# EAGLE design dev_board (EAGLE 5.10)
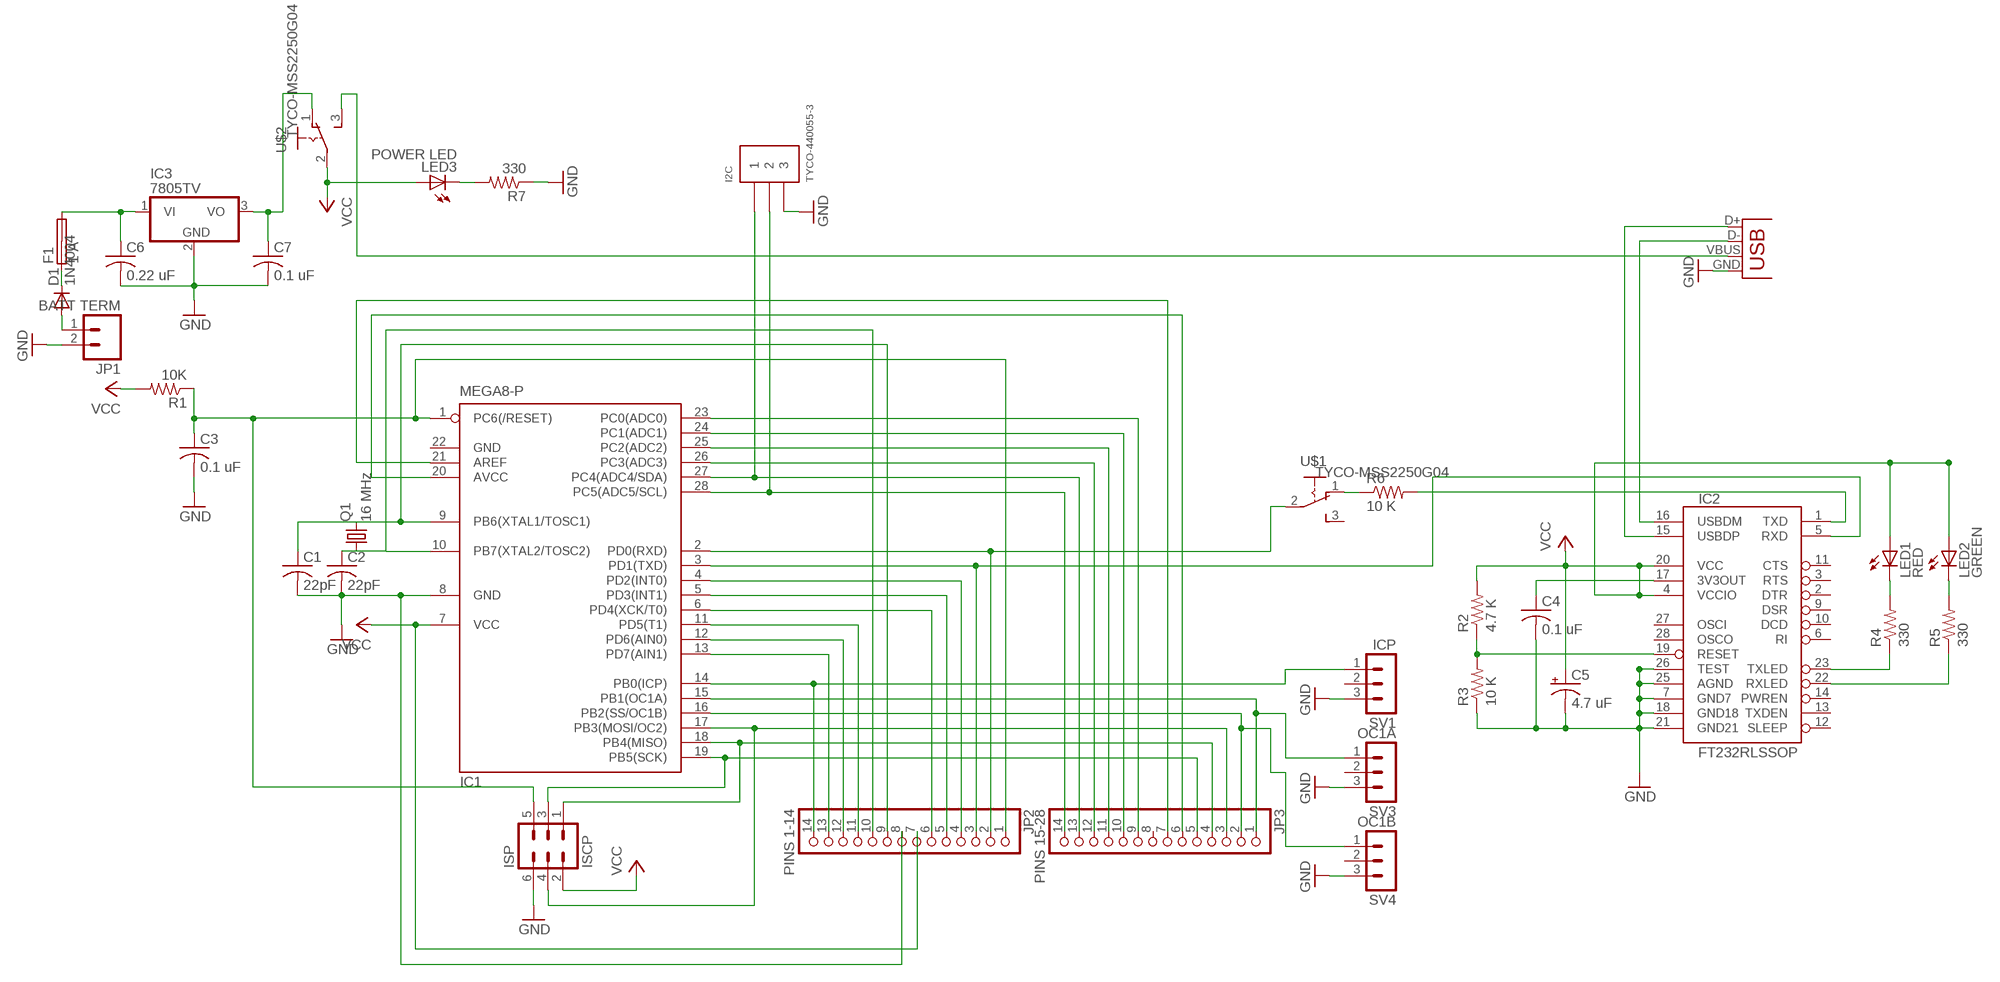
[diagram p0: schematic, sheet 1]

## Parts
C1  22pF  C-US025-025X050  [C025-025X050]
C2  22pF  C-US025-025X050  [C025-025X050]
C3  0.1 uF  C-US050-055X075  [C050-055X075]
C4  0.1 uF  C-US050-055X075  [C050-055X075]
C5  4.7 uF  CPOL-USE2.5-7  [E2,5-7]
C6  0.22 uF  C-US050-055X075  [C050-055X075]
C7  0.1 uF  C-US050-055X075  [C050-055X075]
D1  1N4004  [DO41-10]
F1  1 A  SHK20Q  [SHK20Q]
I2C  TYCO-440055-3  [HEADER-RA-2.00MM-3]
IC1  MEGA8-P  [DIL28-3]
IC2  FT232RLSSOP  [SSOP28DB]
IC3  7805TV  [TO220V]
ISP  ISCP  MA03-2  [MA03-2]
JP1  BATT TERM  M02POLAR  [MOLEX-1X2]
JP2  PINS 1-14  PINHD-1X14  [1X14]
JP3  PINS 15-28  PINHD-1X14  [1X14]
LED1  RED  LED3MM  [LED3MM]
LED2  GREEN  LED3MM  [LED3MM]
LED3  POWER LED  LED3MM  [LED3MM]
Q1  16 MHz  CRYSTALHC18U-V  [HC18U-V]
R1  10K  R-US_0207/10  [0207/10]
R2  4.7 K  R-US_0207/10  [0207/10]
R3  10 K  R-US_0207/10  [0207/10]
R4  330  R-US_0207/10  [0207/10]
R5  330  R-US_0207/10  [0207/10]
R6  10 K  R-US_0207/10  [0207/10]
R7  330  R-US_0207/10  [0207/10]
SV1  ICP  MA03-1  [MA03-1]
SV3  OC1A  MA03-1  [MA03-1]
SV4  OC1B  MA03-1  [MA03-1]
U$1  TYCO-MSS2250G04  [TYCO-MSS2250G04]
U$2  TYCO-MSS2250G04  [TYCO-MSS2250G04]
X1  USBPTH  [USB-B-PTH]

## Nets
GND: C1.2 C2.2 C3.2 C4.2 C5.- C6.2 C7.2 I2C.3 IC1.8(GND) IC2.7(GND7) IC2.18(GND18) IC2.21(GND21) IC2.25(AGND) IC2.26(TEST) IC3.2(GND) ISP.6 JP1.2 JP2.8 R3.1 R7.1 SV1.3 SV3.3 SV4.3 X1.GND
N$1: C1.1 IC1.9(PB6(XTAL1/TOSC1)) JP2.9 Q1.2
N$2: C2.1 IC1.10(PB7(XTAL2/TOSC2)) JP2.10 Q1.1
N$3: R6.1 U$1.1(O)
N$4: C6.1 F1.2A IC3.1(VI)
N$5: U$2.3(S) X1.VBUS
N$6: D1.C F1.1A
N$7: C7.1 IC3.3(VO) U$2.1(O)
N$8: IC1.19(PB5(SCK)) ISP.3 JP3.5
N$9: IC1.18(PB4(MISO)) ISP.1 JP3.4
N$10: IC1.17(PB3(MOSI/OC2)) ISP.4 JP3.3
N$11: C4.1 IC2.17(3V3OUT)
N$12: C3.1 IC1.1(PC6(/RESET)) ISP.5 JP2.1 R1.1
N$13: IC2.1(TXD) R6.2
N$14: D1.A JP1.1
N$15: IC2.16(USBDM) X1.D-
N$16: IC2.15(USBDP) X1.D+
N$17: IC2.19(RESET) R2.1 R3.2
N$18: IC1.4(PD2(INT0)) JP2.4
N$19: LED1.K(C) R4.2
N$20: LED2.K(C) R5.2
N$21: IC2.23(TXLED) R4.1
N$22: IC2.22(RXLED) R5.1
N$23: IC1.5(PD3(INT1)) JP2.5
N$24: IC1.6(PD4(XCK/T0)) JP2.6
N$25: IC1.15(PB1(OC1A)) JP3.1 SV3.1
N$26: IC1.11(PD5(T1)) JP2.11
N$27: IC1.12(PD6(AIN0)) JP2.12
N$28: IC1.13(PD7(AIN1)) JP2.13
N$29: IC1.14(PB0(ICP)) JP2.14 SV1.1
N$30: IC1.16(PB2(SS/OC1B)) JP3.2 SV4.1
N$31: IC1.20(AVCC) JP3.6
N$32: IC1.21(AREF) JP3.7
N$33: IC1.23(PC0(ADC0)) JP3.9
N$34: IC1.24(PC1(ADC1)) JP3.10
N$35: IC1.25(PC2(ADC2)) JP3.11
N$36: IC1.26(PC3(ADC3)) JP3.12
N$37: I2C.1 IC1.27(PC4(ADC4/SDA)) JP3.13
N$38: IC1.3(PD1(TXD)) IC2.5(RXD) JP2.3
N$39: I2C.2 IC1.28(PC5(ADC5/SCL)) JP3.14
N$40: IC1.2(PD0(RXD)) JP2.2 U$1.2(P)
N$41: LED3.K(C) R7.2
VCC: C5.+ IC1.7(VCC) IC2.4(VCCIO) IC2.20(VCC) ISP.2 JP2.7 LED1.A LED2.A LED3.A R1.2 R2.2 U$2.2(P)
Unconnected: F1.1B F1.2B IC2.2(DTR) IC2.3(RTS) IC2.6(RI) IC2.9(DSR) IC2.10(DCD) IC2.11(CTS) IC2.12(SLEEP) IC2.13(TXDEN) IC2.14(PWREN) IC2.27(OSCI) IC2.28(OSCO) JP3.8 SV1.2 SV3.2 SV4.2 U$1.3(S)

## Power pins joined to a net without a drawn wire
GND: IC1.22(GND)

## Library data of the parts
C1-C4 C6 C7 = resistor:C-US: CAPACITOR, American symbol
C5 = resistor:CPOL-US: POLARIZED CAPACITOR, American symbol
D1 = diode:1N4004: DIODE general purpose rectifier, 1 A
F1 = fuse:SHK20Q: FUSE HOLDER 5 x 20 mm, SH contact, E1207 Buerklin 64G6061
I2C = chicagoedt:TYCO-440055-3: 3 pin right angle header with shroud and 2.00 mm pitch.
IC1 = atmel:MEGA8-P: MICROCONTROLLER 8 Kbytes FLASH, 1 kbytes SRAM, 512 bytes EEPROM, USART, 4-channel 10 bit ADC, 2-channel 8 bit ADC Pin compatible with Atmega48, ATMega88, ATMega168 Source: avr.lbr
IC2 = SparkFun:FT232RL: USB UART FT232RL 4th Generation USB UART (USB <-> Serial) Controller. Spark Fun Electronics SKU : COM-00650
IC3 = linear:78*: Positive VOLTAGE REGULATOR Source: http://cache.national.com/ds/LM/LM78L05.pdf http://www.fairchildsemi.com/ds/LM/LM7805.pdf
ISP = con-lstb:MA03-2: PIN HEADER
JP1 = SparkFun:M02: Header 2 Standard 2-pin 0.1" header. Use with straight break away headers (SKU : PRT-00116), right angle break away headers (PRT-00553), swiss pins (PRT-00743), machine pins (PRT-00117), and female headers (PRT-00115). Molex polarized connector foot print use with SKU : PRT-08233 with associated crimp pins and housings.
JP2 JP3 = pinhead:PINHD-1X14: PIN HEADER
LED1 LED2 = led:LED: LED OSRAM: - CHIPLED LG R971, LG N971, LY N971, LG Q971, LY Q971, LO R971, LY R971 LH N974, LH R974 LS Q976, LO Q976, LY Q976 LO Q996 - Hyper CHIPLED LW Q18S LB Q993, LB Q99A, LB R99A - SideLED LS A670, LO A670, LY A670, LG A670, LP A670 LB A673, LV A673, LT A673, LW A673 LH A674 LY A675 LS A676, LA A676, LO A676, LY A676, LW A676 LS A679, LY A679, LG A679 - Hyper Micro SIDELED® LS Y876, LA Y876, LO Y876, LY Y876 LT Y87S - SmartLED LW L88C, LW L88S LB L89C, LB L89S, LG L890 LS L89K, LO L89K, LY L89K LS L896, LA L896, LO L896, LY L896 - TOPLED LS T670, LO T670, LY T670, LG T670, LP T670 LSG T670, LSP T670, LSY T670, LOP T670, LYG T670 LG T671, LOG T671, LSG T671 LB T673, LV T673, LT T673, LW T673 LH T674 LS T676, LA T676, LO T676, LY T676, LB T676, LH T676, LSB T676, LW T676 LB T67C, LV T67C, LT T67C, LS T67K, LO T67K, LY T67K, LW E67C LS E67B, LA E67B, LO E67B, LY E67B, LB E67C, LV E67C, LT E67C LW T67C LS T679, LY T679, LG T679 LS T770, LO T770, LY T770, LG T770, LP T770 LB T773, LV T773, LT T773, LW T773 LH T774 LS E675, LA E675, LY E675, LS T675 LS T776, LA T776, LO T776, LY T776, LB T776 LHGB T686 LT T68C, LB T68C - Hyper Mini TOPLED® LB M676 - Mini TOPLED Santana® LG M470 LS M47K, LO M47K, LY M47K Source: http://www.osram.convergy.de LUXEON: - LUMILED® LXK2-PW12-R00, LXK2-PW12-S00, LXK2-PW14-U00, LXK2-PW14-V00 LXK2-PM12-R00, LXK2-PM12-S00, LXK2-PM14-U00 LXK2-PE12-Q00, LXK2-PE12-R00, LXK2-PE12-S00, LXK2-PE14-T00, LXK2-PE14-U00 LXK2-PB12-K00, LXK2-PB12-L00, LXK2-PB12-M00, LXK2-PB14-N00, LXK2-PB14-P00, LXK2-PB14-Q00 LXK2-PR12-L00, LXK2-PR12-M00, LXK2-PR14-Q00, LXK2-PR14-R00 LXK2-PD12-Q00, LXK2-PD12-R00, LXK2-PD12-S00 LXK2-PH12-R00, LXK2-PH12-S00 LXK2-PL12-P00, LXK2-PL12-Q00, LXK2-PL12-R00 Source: www.luxeon.com KINGBRIGHT: KA-3528ASYC Source: www.kingbright.com
LED3 = SparkFun:LED: LEDs Standard schematic elements and footprints for 5mm, 3mm, 1206, and 0603 sized LEDs. 5mm - Spark Fun Electronics SKU : COM-00529 (and others)
Q1 = crystal:CRYSTAL: CRYSTAL
R1-R7 = resistor:R-US_: RESISTOR, American symbol
SV1 SV3 SV4 = con-lstb:MA03-1: PIN HEADER
U$1 U$2 = chicagoedt:TYCO-MSS2250G04: Switch slide 2POS Tyco Electronics
X1 = SparkFun:USB: USB Connectors USB-B-PTH is fully proven SKU : PRT-00139 USB-miniB is fully proven SKU : PRT-00587 USB-A-PCB is untested. USB-A-H is throughly reviewed, but untested. Spark Fun Electronics SKU : PRT-00437 USB-B-SMT is throughly reviewed, but untested. Needs silkscreen touching up. USB-A-S has not been used/tested USB-MB-H has not been used/tested

## Board
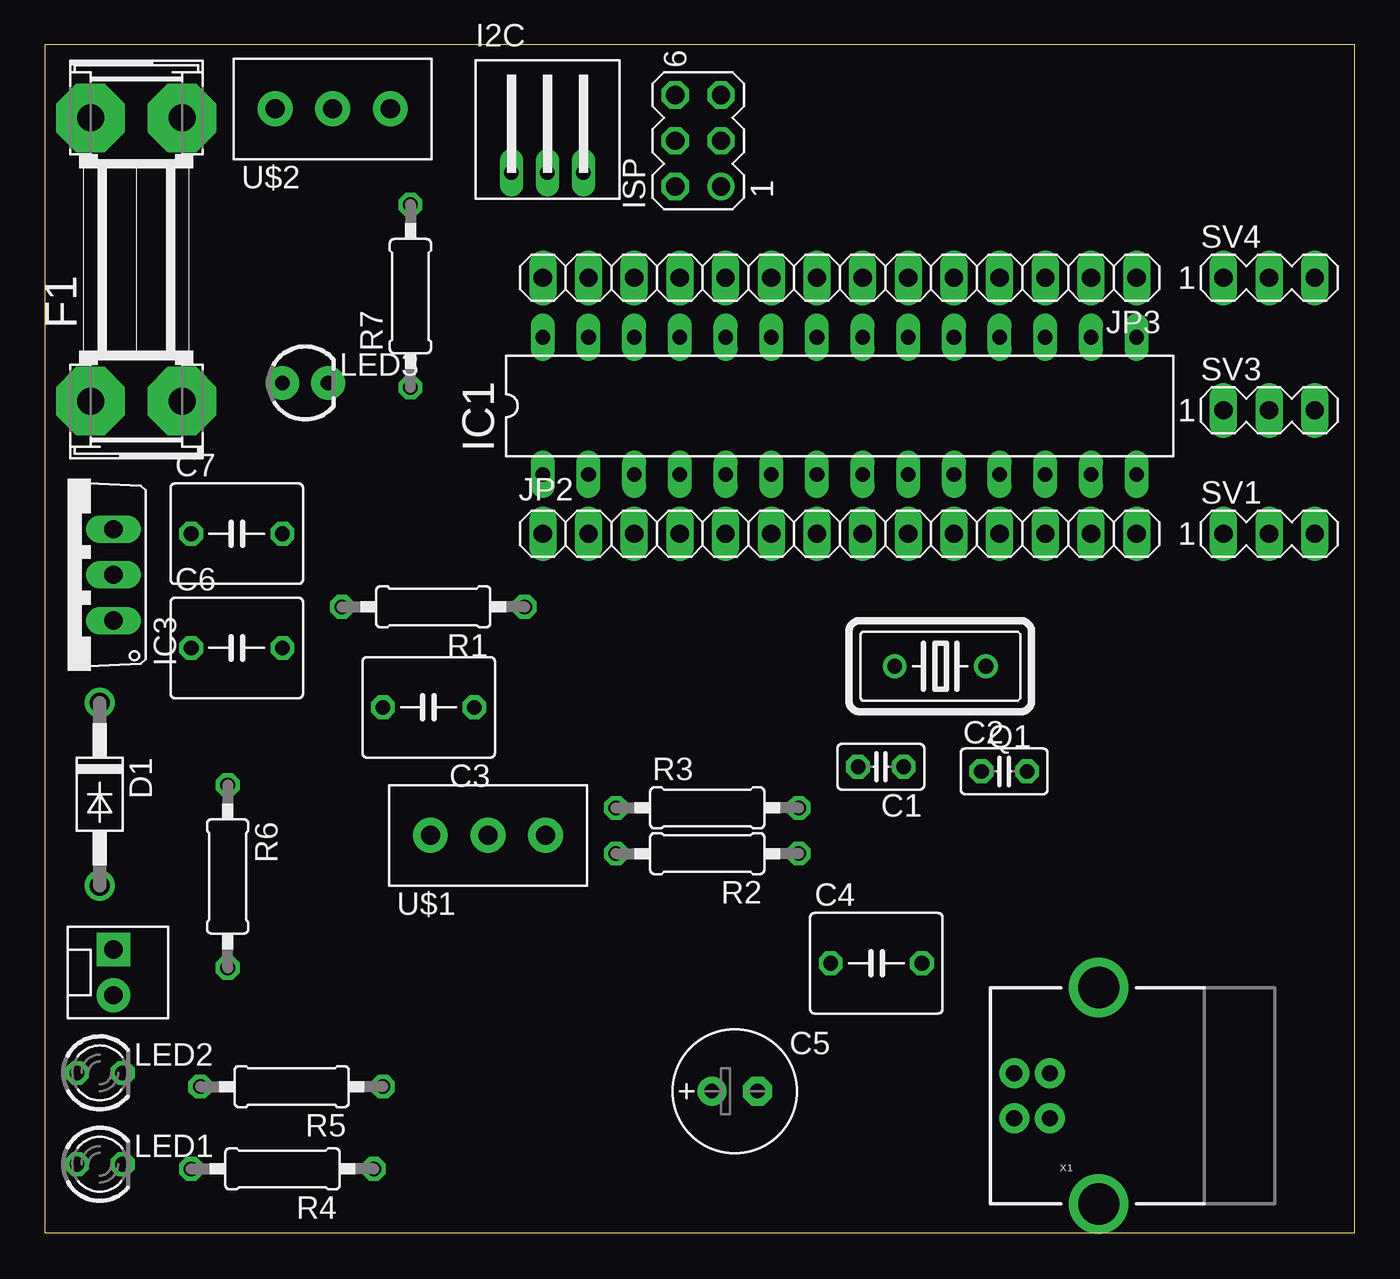
[diagram p1: board, top side]
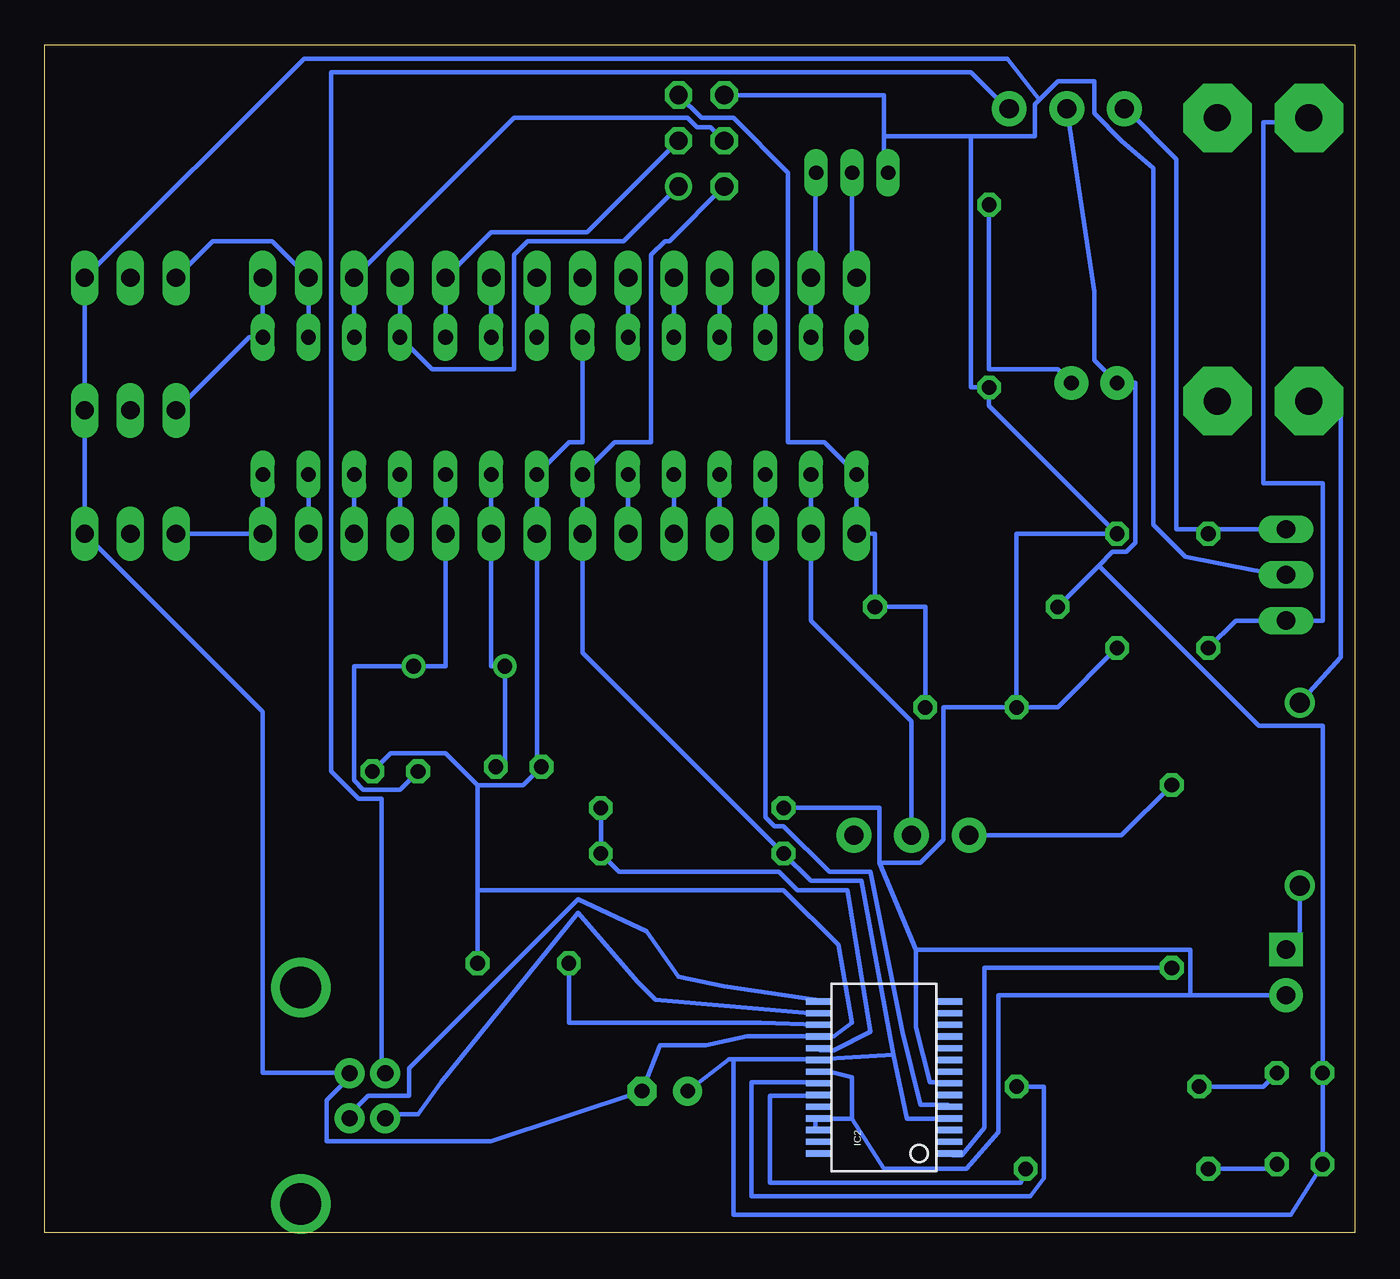
[diagram p2: board, bottom side, seen from below]

Size 72.82 x 66.03 mm. Coordinates in mm from the lower left corner, seen from the top.
Outline: 0,0 72.82,0 72.82,66.03 0,66.03 0,0
Copper layers (1*16): Top 0.035mm / dielectric 1.5mm / Bottom 0.035mm
Design rules "default": minimum track width 10mil, minimum drill 24mil, track to track 8mil, track to pad 8mil, pad to pad 8mil, via to via 8mil, smd to smd 8mil, copper to edge 40mil, drill to drill 8mil, minimum pad ring 10mil, minimum via ring 8mil, stop-mask expansion 4mil, vias tented up to drill 0mil, thermal gap 10mil

### Footprints (pad centres in the part's own frame; a part is rotated, then mirrored left to right if it is on the bottom)
C025-025X050 = drill 0.813 octagon: 1 -1.27,0; 2 1.27,0
C050-055X075 = drill 0.813 octagon: 1 -2.54,0; 2 2.54,0
E2,5-7 = drill 0.813 pad 1.6 round: + -1.27,0 | drill 0.813 pad 1.6 octagon: - 1.27,0
DO41-10 = drill 1.118 round: A 5.08,0; C -5.08,0
SHK20Q = drill 1.5 pad 3.81 octagon: 1A -7.874,2.54; 1B -7.874,-2.54; 2A 7.874,2.54; 2B 7.874,-2.54
HEADER-RA-2.00MM-3 = drill 0.8 long: 1 2,0; 2 0,0; 3 -2,0
DIL28-3 = drill 0.813 long: 1 -16.51,-3.81; 2 -13.97,-3.81; 3 -11.43,-3.81; 4 -8.89,-3.81; 5 -6.35,-3.81; 6 -3.81,-3.81; 7 -1.27,-3.81; 8 1.27,-3.81; 9 3.81,-3.81; 10 6.35,-3.81; 11 8.89,-3.81; 12 11.43,-3.81; 13 13.97,-3.81; 14 16.51,-3.81; 15 16.51,3.81; 16 13.97,3.81; 17 11.43,3.81; 18 8.89,3.81; 19 6.35,3.81; 20 3.81,3.81; 21 1.27,3.81; 22 -1.27,3.81; 23 -3.81,3.81; 24 -6.35,3.81; 25 -8.89,3.81; 26 -11.43,3.81; 27 -13.97,3.81; 28 -16.51,3.81
SSOP28DB = smd 0.348 x 1.397: 1 -4.225,-3.656; 2 -3.575,-3.656; 3 -2.925,-3.656; 4 -2.275,-3.656; 5 -1.625,-3.656; 6 -0.975,-3.656; 7 -0.325,-3.656; 8 0.325,-3.656; 9 0.975,-3.656; 10 1.625,-3.656; 11 2.275,-3.656; 12 2.925,-3.656; 13 3.575,-3.656; 14 4.225,-3.656; 15 4.225,3.656; 16 3.575,3.656; 17 2.925,3.656; 18 2.275,3.656; 19 1.625,3.656; 20 0.975,3.656; 21 0.325,3.656; 22 -0.325,3.656; 23 -0.975,3.656; 24 -1.625,3.656; 25 -2.275,3.656; 26 -2.925,3.656; 27 -3.575,3.656; 28 -4.225,3.656
TO220V = drill 1.016 long: 1 -2.54,-2.54; 2 0,-2.54; 3 2.54,-2.54
MA03-2 = drill 1.016 round: 1 -2.54,-1.27 | drill 1.016 octagon: 2 -2.54,1.27; 3 0,-1.27; 4 0,1.27; 5 2.54,-1.27; 6 2.54,1.27
MOLEX-1X2 = drill 1.016 pad 1.88 square: 1 0,0 | drill 1.016 pad 1.88 round: 2 2.54,0
1X14 = drill 1.016 long: 1 -16.51,0; 2 -13.97,0; 3 -11.43,0; 4 -8.89,0; 5 -6.35,0; 6 -3.81,0; 7 -1.27,0; 8 1.27,0; 9 3.81,0; 10 6.35,0; 11 8.89,0; 12 11.43,0; 13 13.97,0; 14 16.51,0
LED3MM = drill 0.813 octagon: A -1.27,0; K 1.27,0
LED3MM' = drill 0.813 pad 1.88 round: A -1.27,0; K 1.27,0
HC18U-V = drill 0.813 round: 1 -2.54,0; 2 2.54,0
0207/10 = drill 0.813 octagon: 1 -5.08,0; 2 5.08,0
MA03-1 = drill 1.016 long: 1 -2.54,0; 2 0,0; 3 2.54,0
TYCO-MSS2250G04 = drill 1.067 pad 1.93 round: 1 -3.2,0; 2 0,0; 3 3.2,0
USB-B-PTH = drill 0.914 pad 1.676 round: D+ 0,1.25; D- 1.981,1.25; GND 0,-1.25; VBUS 1.981,-1.25 | drill 2.286 round: P$1 -2.718,-6.02; P$2 -2.718,6.02

### Placement (x,y rotation side)
C1  46.48,25.91 180 top
C2  53.34,25.65 0 top
C3  21.34,29.21 180 top
C4  46.23,14.99 0 top
C5  38.35,7.87 0 top
C6  10.67,32.51 0 top
C7  10.67,38.86 0 top
D1  3.05,24.38 270 top
F1  5.08,54.1 90 top
I2C  27.94,58.93 0 top
IC1  44.2,45.97 0 top
IC2  26.16,8.64 90 bottom
IC3  1.27,36.58 90 top
ISP  36.32,60.71 90 top
JP1  3.81,15.75 270 top
JP2  44.2,38.86 0 top
JP3  44.2,53.09 180 top
LED1  3.05,3.81 0 top
LED2  3.05,8.89 0 top
LED3  POWER LED  [LED3MM']  14.48,47.24 0 top
Q1  49.78,31.5 180 top
R1  21.59,34.8 180 top
R2  36.83,21.08 180 top
R3  36.83,23.62 0 top
R4  13.21,3.56 180 top
R5  13.72,8.13 180 top
R6  10.16,19.81 270 top
R7  20.32,52.07 90 top
SV1  68.07,38.86 0 top
SV3  68.07,45.72 0 top
SV4  68.07,53.09 0 top
U$1  24.64,22.1 0 top
U$2  16,62.48 0 top
X1  55.88,7.62 180 top

### Tracks (layer width: path | path; a pad name or v marks a point on that pad's centre or on a via)
GND
  Bottom 0.254: IC1.22 42.93,43.94 43.69,43.94 IC1.8 JP2.8 45.47,25.91 C1.2 46.23,24.89 48.77,24.89 | 48.77,19.05 48.77,24.89 | 48.77,19.05 C4.2 | C2.2 53.59,26.67 50.55,26.67 48.77,24.89 | 48.77,19.05 31.75,19.05 28.7,16 27.94,11.68 28.96,10.92 29.72,10.92 IC2.18 29.97,10.92 33.78,10.92 36.07,10.41 38.61,10.41 C5.- 48.01,5.08 57.15,5.08 57.15,7.37 55.88,8.64 X1.GND 55.88,8.89 60.71,8.89 60.71,28.96 SV1.3 SV3.3 SV4.3 58.42,65.28 19.3,65.28 17.53,62.99 | 26.16,60.96 26.16,63.25 ISP.6 | 26.16,60.96 26.16,58.93 I2C.3 | IC3.2 5.59,36.83 9.4,37.59 11.18,39.37 11.18,59.18 12.95,60.71 14.48,62.23 14.48,64.01 16.51,64.01 17.53,62.99 | 17.53,62.99 17.78,62.74 17.78,60.96 21.34,60.96 | 21.34,60.96 26.16,60.96 | IC2.26 29.97,5.84 29.97,6.35 IC2.25 29.72,6.35 27.94,6.35 | 27.94,6.35 27.94,8.64 28.96,8.89 29.72,8.89 IC2.21 | 27.94,6.35 26.16,3.56 21.59,3.56 19.81,5.59 19.81,13.21 9.14,13.21 | JP1.2 9.14,13.21 | 26.42,20.57 26.42,23.62 R3.1 | 24.38,15.75 26.42,20.57 | 24.38,15.75 24.38,11.43 23.62,8.38 22.61,8.38 IC2.7 | C6.2 16.51,29.21 C3.2 | C3.2 18.8,38.86 C7.2 20.32,45.97 R7.1 21.34,46.99 21.34,60.96 | 26.42,20.57 24.13,20.57 22.86,21.84 22.86,29.21 C3.2 | 9.14,13.21 9.14,15.75 24.38,15.75
N$1
  Bottom 0.254: IC1.9 JP2.9 48.01,31.5 Q1.2 47.24,25.91 C1.1
N$2
  Bottom 0.254: IC1.10 JP2.10 50.55,31.5 Q1.1 55.63,31.5 55.63,25.15 55.12,24.64 53.09,24.64 C2.1
N$3
  Bottom 0.254: R6.1 12.95,22.1 U$1.1
N$4
  Bottom 0.254: C6.1 6.6,34.04 IC3.1 1.78,34.04 1.78,41.66 5.08,41.66 5.08,61.72 2.54,61.72 F1.2A
N$5
  Bottom 0.254: X1.VBUS 54.1,8.89 54.1,24.13 55.37,24.13 56.9,25.65 56.9,64.52 21.34,64.52 19.3,62.48 U$2.3
N$6
  Bottom 0.254: D1.C 0.76,32 0.76,46.23 F1.1A
N$7
  Bottom 0.254: IC3.3 7.87,39.12 | 7.87,39.12 9.91,39.12 9.91,59.69 12.7,62.48 U$2.1 | 7.87,39.12 C7.1
N$8
  Bottom 0.254: IC1.19 JP3.5 48.01,55.63 42.67,55.63 ISP.3
N$9
  Bottom 0.254: JP3.4 IC1.18 51.31,48.01 46.74,48.01 46.74,54.36 45.97,55.12 40.64,55.12 ISP.1
N$10
  Bottom 0.254: IC1.17 JP3.3 46.74,61.98 37.08,61.98 36.58,61.47 35.81,61.47 ISP.4
N$11
  Bottom 0.254: C4.1 43.69,11.68 33.02,11.68 IC2.17
N$12
  Bottom 0.254: C3.1 23.88,34.8 R1.1 26.67,38.86 JP2.1 IC1.1 29.46,43.94 31.5,43.94 31.5,58.93 34.54,61.98 36.32,61.98 ISP.5
N$13
  Bottom 0.254: R6.2 20.57,14.73 20.57,5.84 21.84,4.32 22.35,4.32 IC2.1
N$14
  Bottom 0.254: D1.A 3.05,15.75 JP1.1
N$15
  Bottom 0.254: IC2.16 29.97,12.19 38.86,12.95 39.88,13.97 43.18,17.78 50.8,8.38 52.07,6.6 53.85,6.6 X1.D-
N$16
  Bottom 0.254: IC2.15 29.97,12.95 35.05,13.72 37.59,14.22 39.37,16.76 43.18,18.54 52.58,9.14 52.58,7.62 54.86,7.62 55.88,6.6 X1.D+
N$17
  Bottom 0.254: IC2.19 29.72,10.16 28.96,10.16 26.92,11.18 28.19,19.05 30.99,19.05 32,20.07 40.89,20.07 R2.1 R3.2
N$18
  Bottom 0.254: JP2.4 IC1.4
N$19
  Bottom 0.254: LED1.K 4.57,3.56 R4.2
N$20
  Bottom 0.254: LED2.K 5.08,8.13 R5.2
N$21
  Bottom 0.254: R4.1 18.54,2.79 32.51,2.79 32.51,7.62 29.97,7.62 IC2.23
N$22
  Bottom 0.254: R5.1 17.27,8.13 17.27,3.05 18.03,2.03 33.53,2.03 33.53,8.38 29.97,8.38 IC2.22
N$23
  Bottom 0.254: JP2.5 IC1.5
N$24
  Bottom 0.254: JP2.6 IC1.6
N$25
  Bottom 0.254: JP3.1 IC1.15 61.47,49.78 SV3.1
N$26
  Bottom 0.254: JP2.11 IC1.11
N$27
  Bottom 0.254: JP2.12 IC1.12
N$28
  Bottom 0.254: JP2.13 IC1.13
N$29
  Bottom 0.254: IC1.14 JP2.14 SV1.1
N$30
  Bottom 0.254: IC1.16 JP3.2 60.2,55.12 63.5,55.12 SV4.1
N$31
  Bottom 0.254: IC1.20 JP3.6
N$32
  Bottom 0.254: IC1.21 JP3.7
N$33
  Bottom 0.254: IC1.23 JP3.9
N$34
  Bottom 0.254: IC1.24 JP3.10
N$35
  Bottom 0.254: IC1.25 JP3.11
N$36
  Bottom 0.254: IC1.26 JP3.12
N$37
  Bottom 0.254: I2C.1 29.97,58.93 29.97,53.09 JP3.13 IC1.27
N$38
  Bottom 0.254: IC2.5 22.61,7.11 24.13,7.11 25.15,11.18 26.92,20.07 29.21,20.07 31.75,22.61 32.26,22.61 32.77,23.11 JP2.3 IC1.3
N$39
  Bottom 0.254: I2C.2 27.94,53.09 JP3.14 IC1.28
N$40
  Bottom 0.254: IC1.2 JP2.2 30.23,34.04 24.64,28.45 U$1.2
N$41
  Bottom 0.254: R7.2 20.32,48.01 16.51,48.01 LED3.K
VCC
  Bottom 0.254: 25.65,9.91 24.89,6.35 22.61,6.35 IC2.4 | 25.65,9.91 29.72,9.65 IC2.20 29.97,9.65 34.54,9.65 | 25.65,9.91 27.43,19.56 30.23,19.56 R2.2 42.93,32.26 JP2.7 IC1.7 41.15,43.94 39.12,43.94 39.12,54.36 38.35,55.12 38.1,55.12 ISP.2 | C5.+ 34.8,9.65 34.54,9.65 | 14.22,37.08 13.46,37.85 12.7,37.85 12.19,38.35 12.19,47.24 LED3.A 14.48,48.51 14.48,52.32 U$2.2 | 14.22,37.08 R1.2 | 14.22,37.08 5.33,28.19 1.78,28.19 LED2.A LED1.A 3.56,1.02 34.54,1.02 34.54,9.65